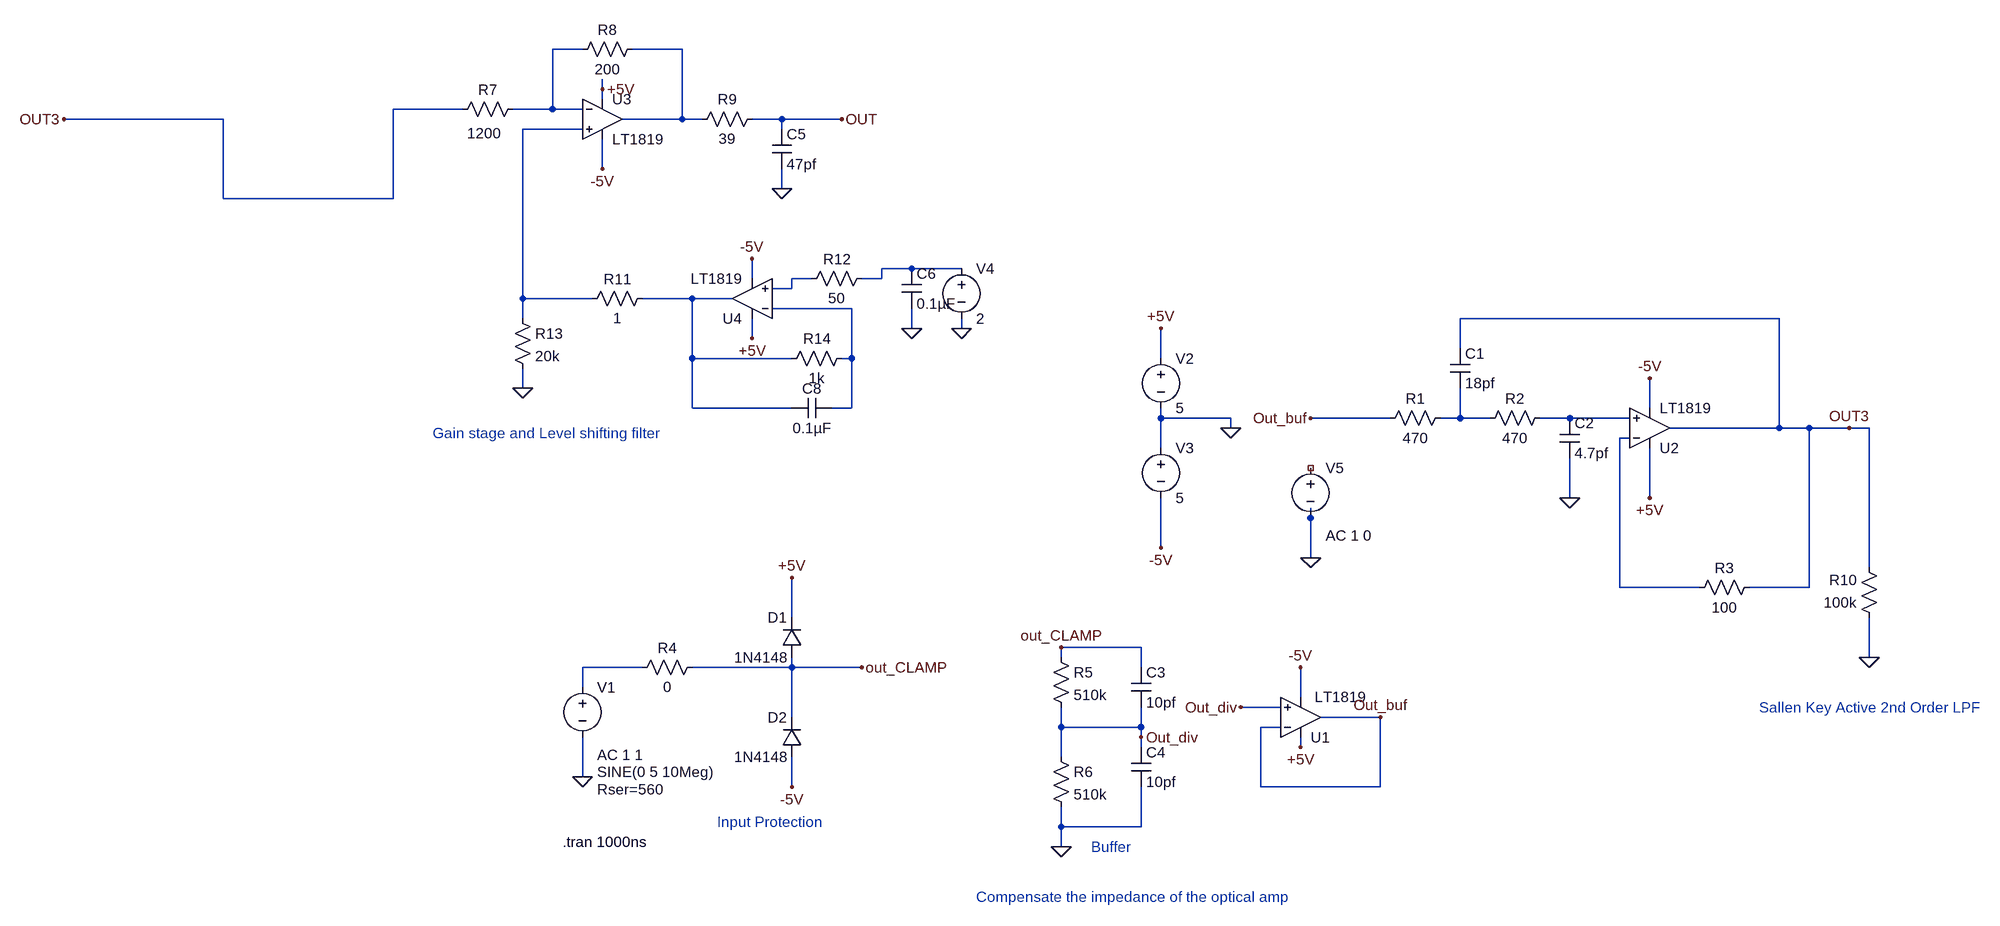
[diagram p0: schematic SecondOrder1.asc]
SecondOrder1.asc, the LTspice schematic file:
Version 4
SHEET 1 1116 1888
WIRE -1408 80 -1456 80
WIRE -1248 80 -1328 80
WIRE -1376 144 -1376 128
WIRE -1376 160 -1376 144
WIRE -1600 176 -1712 176
WIRE -1456 176 -1456 80
WIRE -1456 176 -1520 176
WIRE -1408 176 -1456 176
WIRE -1984 192 -2240 192
WIRE -1248 192 -1248 80
WIRE -1248 192 -1344 192
WIRE -1216 192 -1248 192
WIRE -1088 192 -1136 192
WIRE -992 192 -1088 192
WIRE -1408 208 -1504 208
WIRE -1088 208 -1088 192
WIRE -1376 272 -1376 224
WIRE -1088 304 -1088 272
WIRE -1984 320 -1984 192
WIRE -1712 320 -1712 176
WIRE -1712 320 -1984 320
WIRE -880 432 -928 432
WIRE -800 432 -880 432
WIRE -1136 448 -1136 416
WIRE -1040 448 -1072 448
WIRE -928 448 -928 432
WIRE -928 448 -960 448
WIRE -1072 464 -1072 448
WIRE -1072 464 -1104 464
WIRE -1504 480 -1504 208
WIRE -1392 480 -1504 480
WIRE -1232 480 -1312 480
WIRE -1168 480 -1232 480
WIRE -976 496 -1104 496
WIRE -1504 512 -1504 480
WIRE 512 512 0 512
WIRE -880 528 -880 496
WIRE -800 528 -800 512
WIRE -1136 544 -1136 512
WIRE 0 560 0 512
WIRE -1232 576 -1232 480
WIRE -1072 576 -1232 576
WIRE -976 576 -976 496
WIRE -976 576 -992 576
WIRE -480 576 -480 528
WIRE -1504 624 -1504 592
WIRE -1232 656 -1232 576
WIRE -1072 656 -1232 656
WIRE -976 656 -976 576
WIRE -976 656 -1008 656
WIRE 304 656 304 608
WIRE -480 672 -480 656
WIRE -368 672 -480 672
WIRE -112 672 -240 672
WIRE 0 672 0 624
WIRE 0 672 -32 672
WIRE 48 672 0 672
WIRE 176 672 128 672
WIRE 272 672 176 672
WIRE -368 688 -368 672
WIRE 512 688 512 512
WIRE 512 688 336 688
WIRE 560 688 512 688
WIRE 624 688 560 688
WIRE 656 688 624 688
WIRE 272 704 256 704
WIRE -480 720 -480 672
WIRE 176 800 176 736
WIRE 304 800 304 720
WIRE -240 832 -240 816
WIRE -480 880 -480 800
WIRE -240 896 -240 832
WIRE 656 912 656 688
WIRE 256 944 256 704
WIRE 384 944 256 944
WIRE 560 944 560 688
WIRE 560 944 464 944
WIRE -1072 992 -1072 928
WIRE -512 1040 -640 1040
WIRE -640 1056 -640 1040
WIRE 656 1056 656 992
WIRE -1312 1072 -1408 1072
WIRE -1072 1072 -1072 1056
WIRE -1072 1072 -1232 1072
WIRE -960 1072 -1072 1072
WIRE -512 1072 -512 1040
WIRE -1408 1104 -1408 1072
WIRE -256 1120 -256 1072
WIRE -288 1136 -352 1136
WIRE -1072 1152 -1072 1072
WIRE -128 1152 -224 1152
WIRE -640 1168 -640 1136
WIRE -512 1168 -512 1136
WIRE -512 1168 -640 1168
WIRE -288 1168 -320 1168
WIRE -512 1184 -512 1168
WIRE -512 1200 -512 1184
WIRE -256 1200 -256 1184
WIRE -640 1216 -640 1168
WIRE -1408 1248 -1408 1184
WIRE -1072 1264 -1072 1216
WIRE -320 1264 -320 1168
WIRE -128 1264 -128 1152
WIRE -128 1264 -320 1264
WIRE -640 1328 -640 1296
WIRE -512 1328 -512 1264
WIRE -512 1328 -640 1328
WIRE -640 1360 -640 1328
FLAG -368 688 0
FLAG -480 528 +5V
FLAG -480 880 -5V
FLAG -240 896 0
FLAG 176 800 0
FLAG 656 1056 0
FLAG 304 608 -5V
FLAG 304 800 +5V
FLAG 624 688 OUT3
FLAG -1408 1248 0
FLAG -1072 928 +5V
FLAG -1072 1264 -5V
FLAG -960 1072 out_CLAMP
FLAG -640 1040 out_CLAMP
FLAG -512 1184 Out_div
FLAG -352 1136 Out_div
FLAG -128 1152 Out_buf
FLAG -256 1072 -5V
FLAG -256 1200 +5V
FLAG -1504 624 0
FLAG -880 528 0
FLAG -800 528 0
FLAG -1088 304 0
FLAG -992 192 OUT
FLAG -1376 144 +5V
FLAG -1376 272 -5V
FLAG -1136 416 -5V
FLAG -1136 544 +5V
FLAG -640 1360 0
FLAG -240 672 Out_buf
FLAG -2240 192 OUT3
DATAFLAG -1232 192 ""
SYMBOL voltage -480 560 R0
WINDOW 123 0 0 Left 2
WINDOW 39 0 0 Left 2
SYMATTR InstName V2
SYMATTR Value 5
SYMBOL voltage -480 704 R0
WINDOW 123 0 0 Left 2
WINDOW 39 0 0 Left 2
SYMATTR InstName V3
SYMATTR Value 5
SYMBOL voltage -240 736 R0
WINDOW 123 24 124 Left 2
WINDOW 39 0 0 Left 2
SYMATTR Value2 AC 1 0
SYMATTR InstName V5
SYMATTR Value ""
SYMBOL res -16 656 R90
WINDOW 0 0 56 VBottom 2
WINDOW 3 32 56 VTop 2
SYMATTR InstName R1
SYMATTR Value 470
SYMBOL res 144 656 R90
WINDOW 0 0 56 VBottom 2
WINDOW 3 32 56 VTop 2
SYMATTR InstName R2
SYMATTR Value 470
SYMBOL res 672 1008 R180
WINDOW 0 36 76 Left 2
WINDOW 3 36 40 Left 2
SYMATTR InstName R10
SYMATTR Value 100k
SYMBOL res 368 960 R270
WINDOW 0 32 56 VTop 2
WINDOW 3 0 56 VBottom 2
SYMATTR InstName R3
SYMATTR Value 100
SYMBOL Opamps\\LT1819 304 688 M180
SYMATTR InstName U2
SYMBOL cap 160 672 R0
SYMATTR InstName C2
SYMATTR Value 4.7pf
SYMBOL cap -16 560 R0
SYMATTR InstName C1
SYMATTR Value 18pf
SYMBOL voltage -1408 1088 R0
WINDOW 3 24 152 Left 2
WINDOW 123 24 124 Left 2
WINDOW 39 24 180 Left 2
SYMATTR Value SINE(0 5 10Meg)
SYMATTR Value2 AC 1 1
SYMATTR SpiceLine Rser=560
SYMATTR InstName V1
SYMBOL res -1216 1056 R90
WINDOW 0 0 56 VBottom 2
WINDOW 3 32 56 VTop 2
SYMATTR InstName R4
SYMATTR Value 0
SYMBOL diode -1056 1056 R180
WINDOW 0 24 64 Left 2
WINDOW 3 24 0 Left 2
SYMATTR InstName D1
SYMATTR Value 1N4148
SYMBOL diode -1056 1216 R180
WINDOW 0 24 64 Left 2
WINDOW 3 24 0 Left 2
SYMATTR InstName D2
SYMATTR Value 1N4148
SYMBOL res -656 1040 R0
SYMATTR InstName R5
SYMATTR Value 510k
SYMBOL res -656 1200 R0
SYMATTR InstName R6
SYMATTR Value 510k
SYMBOL cap -528 1072 R0
SYMATTR InstName C3
SYMATTR Value 10pf
SYMBOL cap -528 1200 R0
SYMATTR InstName C4
SYMATTR Value 10pf
SYMBOL Opamps\\LT1819 -256 1152 M180
WINDOW 3 23 33 Left 2
SYMATTR InstName U1
SYMBOL res -1504 160 R90
WINDOW 0 0 56 VBottom 2
WINDOW 3 39 62 VTop 2
SYMATTR InstName R7
SYMATTR Value 1200
SYMBOL res -1312 64 R90
WINDOW 0 0 56 VBottom 2
WINDOW 3 32 56 VTop 2
SYMATTR InstName R8
SYMATTR Value 200
SYMBOL res -1120 176 R90
WINDOW 0 0 56 VBottom 2
WINDOW 3 32 56 VTop 2
SYMATTR InstName R9
SYMATTR Value 39
SYMBOL res -1296 464 R90
WINDOW 0 0 56 VBottom 2
WINDOW 3 32 56 VTop 2
SYMATTR InstName R11
SYMATTR Value 1
SYMBOL res -944 432 R90
WINDOW 0 0 56 VBottom 2
WINDOW 3 32 56 VTop 2
SYMATTR InstName R12
SYMATTR Value 50
SYMBOL res -1520 496 R0
SYMATTR InstName R13
SYMATTR Value 20k
SYMBOL Opamps\\LT1819 -1376 192 R0
SYMATTR InstName U3
SYMBOL Opamps\\LT1819 -1136 480 R180
SYMATTR InstName U4
SYMBOL cap -1104 208 R0
SYMATTR InstName C5
SYMATTR Value 47pf
SYMBOL cap -896 432 R0
SYMATTR InstName C6
SYMATTR Value 0.1µF
SYMBOL cap -1008 640 R90
WINDOW 0 0 32 VBottom 2
WINDOW 3 32 32 VTop 2
SYMATTR InstName C8
SYMATTR Value 0.1µF
SYMBOL res -976 560 R90
WINDOW 0 0 56 VBottom 2
WINDOW 3 32 56 VTop 2
SYMATTR InstName R14
SYMATTR Value 1k
SYMBOL voltage -800 416 R0
WINDOW 123 0 0 Left 2
WINDOW 39 0 0 Left 2
SYMATTR InstName V4
SYMATTR Value 2
TEXT 480 1136 Left 2 ;Sallen Key Active 2nd Order LPF
TEXT -1192 1320 Left 2 ;Input Protection
TEXT -1440 1352 Left 2 !.tran 1000ns
TEXT -592 1360 Left 2 ;Buffer
TEXT -1648 696 Left 2 ;Gain stage and Level shifting filter
TEXT -776 1440 Left 2 ;Compensate the impedance of the optical amp

The netlist it stands for:
* SecondOrder1.asc
V2 +5V 0 5
V3 0 -5V 5
V5 NC_01 0 AC 1 0
R1 N008 Out_buf 470
R2 N009 N008 470
R10 0 OUT3 100k
R3 N010 OUT3 100
* U2: LT1819 (symbol Opamps\LT1819 not available, pins judged from their places): In+=N009 In-=N010 V+=+5V V-=-5V OUT=OUT3
C2 N009 0 4.7pf
C1 OUT3 N008 18pf
V1 N011 0 SINE(0 5 10Meg) AC 1 1 Rser=560
R4 out_CLAMP N011 0
D1 out_CLAMP +5V 1N4148
D2 -5V out_CLAMP 1N4148
R5 out_CLAMP Out_div 510k
R6 Out_div 0 510k
C3 out_CLAMP Out_div 10pf
C4 Out_div 0 10pf
* U1: LT1819 (symbol Opamps\LT1819 not available, pins judged from their places): In+=Out_div In-=Out_buf V+=+5V V-=-5V OUT=Out_buf
R7 N001 OUT3 1200
R8 N002 N001 200
R9 OUT N002 39
R11 N006 N003 1
R12 N004 N005 50
R13 N003 0 20k
* U3: LT1819 (symbol Opamps\LT1819 not available, pins judged from their places): In+=N003 In-=N001 V+=+5V V-=-5V OUT=N002
* U4: LT1819 (symbol Opamps\LT1819 not available, pins judged from their places): In+=N005 In-=N007 V+=+5V V-=-5V OUT=N006
C5 OUT 0 47pf
C6 N004 0 0.1µF
C8 N007 N006 0.1µF
R14 N007 N006 1k
V4 N004 0 2
.model D D
.lib standard.dio
* Sallen Key Active 2nd Order LPF
* Input Protection
.tran 1000ns
* Buffer
* Gain stage and Level shifting filter
* Compensate the impedance of the optical amp
.backanno
.end